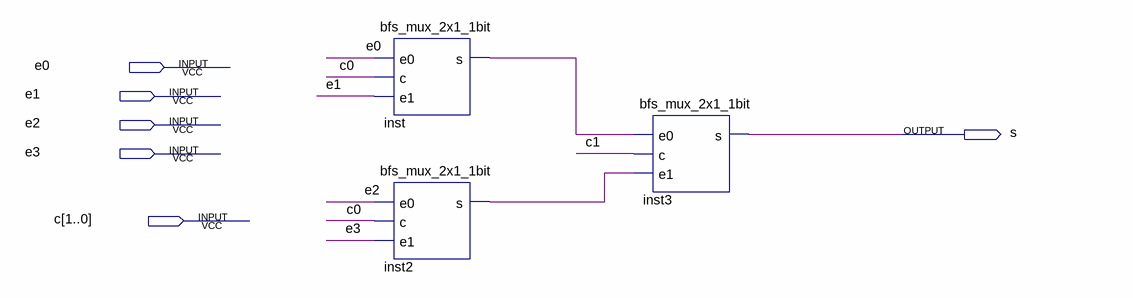
[diagram p0: schematic sheet]
// Quartus schematic bfs_mux_4x1_1bit.bdf as structural Verilog: 3 symbols, 6 pins
module bfs_mux_4x1_1bit (
  input  e0,
  input  e1,
  input  e2,
  input  e3,
  input  [1:0] c,
  output s
);

  wire inst2_s, inst_s;

  bfs_mux_2x1_1bit inst (.e0(e0), .c(c[0]), .e1(e1), .s(inst_s));
  bfs_mux_2x1_1bit inst2 (.e0(e2), .c(c[0]), .e1(e3), .s(inst2_s));
  bfs_mux_2x1_1bit inst3 (.e0(inst_s), .c(c[1]), .e1(inst2_s), .s(s));
endmodule
